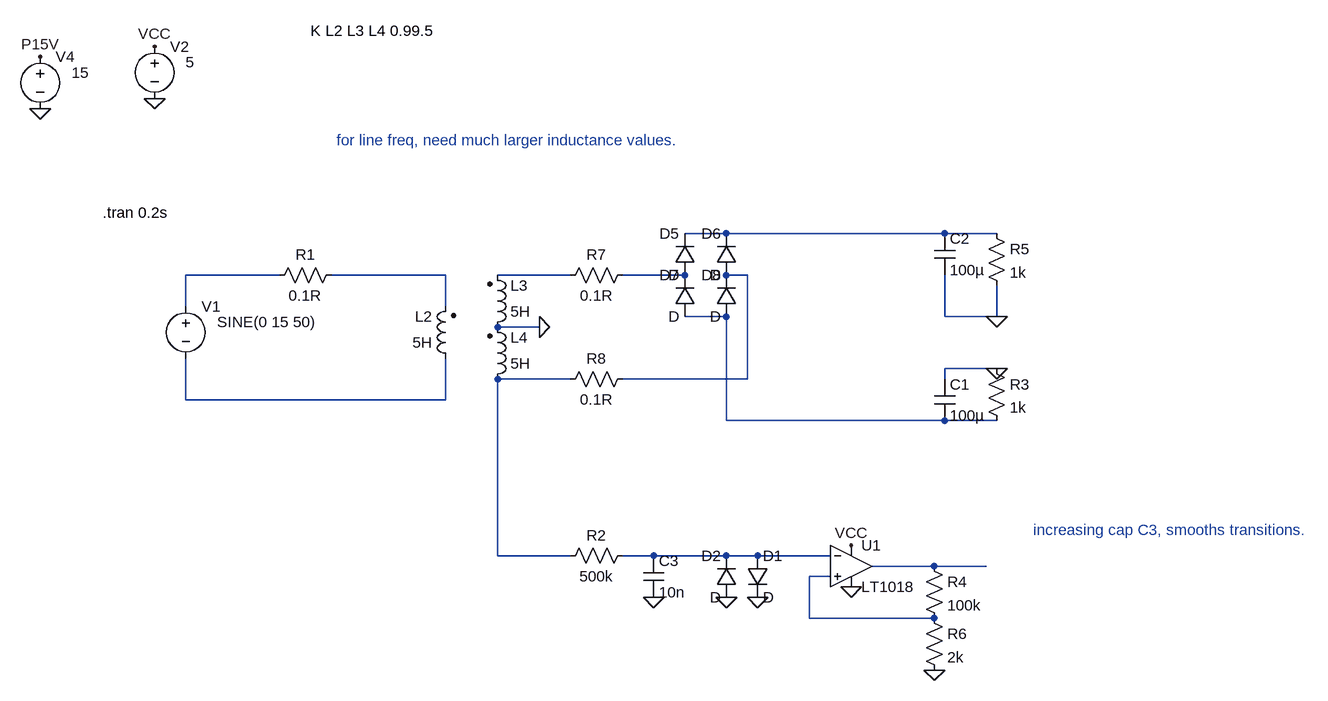
[diagram p0: schematic Draft101.asc]
Draft101.asc, the LTspice schematic file:
Version 4
SHEET 1 5720 1740
WIRE 1664 -144 1600 -144
WIRE 2000 -144 1664 -144
WIRE 2080 -144 2000 -144
WIRE 976 -80 832 -80
WIRE 1232 -80 1056 -80
WIRE 1424 -80 1312 -80
WIRE 1600 -80 1504 -80
WIRE 1696 -80 1664 -80
WIRE 832 -32 832 -80
WIRE 1232 -32 1232 -80
WIRE 1664 -16 1600 -16
WIRE 2000 -16 2000 -80
WIRE 2080 -16 2080 -64
WIRE 2080 -16 2000 -16
WIRE 1376 0 1312 0
WIRE 2080 64 2000 64
WIRE 1424 80 1312 80
WIRE 1696 80 1696 -80
WIRE 1696 80 1504 80
WIRE 2000 80 2000 64
WIRE 832 112 832 48
WIRE 1232 112 1232 48
WIRE 1232 112 832 112
WIRE 1664 144 1664 -16
WIRE 2000 144 1664 144
WIRE 2080 144 2000 144
WIRE 1312 352 1312 80
WIRE 1424 352 1312 352
WIRE 1552 352 1504 352
WIRE 1664 352 1552 352
WIRE 1712 352 1664 352
WIRE 1824 352 1712 352
WIRE 1984 368 1888 368
WIRE 2064 368 1984 368
WIRE 1824 384 1792 384
WIRE 1792 448 1792 384
WIRE 1984 448 1792 448
FLAG 784 -352 0
FLAG 784 -432 VCC
FLAG 608 -336 0
FLAG 608 -416 P15V
FLAG 2080 -16 0
FLAG 1376 0 0
FLAG 2080 64 0
FLAG 1856 400 0
FLAG 1856 336 VCC
FLAG 1664 416 0
FLAG 1712 416 0
FLAG 1984 528 0
FLAG 1552 416 0
SYMBOL voltage 784 -448 R0
WINDOW 123 0 0 Left 0
WINDOW 39 0 0 Left 0
WINDOW 3 48 40 Left 2
SYMATTR Value 5
SYMATTR InstName V2
SYMBOL ind2 1296 16 M180
WINDOW 0 36 80 Left 2
WINDOW 3 36 40 Left 2
SYMATTR InstName L3
SYMATTR Value 5H
SYMATTR Type ind
SYMBOL voltage 608 -432 R0
WINDOW 123 0 0 Left 0
WINDOW 39 0 0 Left 0
WINDOW 3 48 40 Left 2
SYMATTR Value 15
SYMATTR InstName V4
SYMBOL ind2 1248 64 R180
WINDOW 0 36 80 Left 2
WINDOW 3 36 40 Left 2
SYMATTR InstName L2
SYMATTR Value 5H
SYMATTR Type ind
SYMBOL diode 1616 -80 R180
WINDOW 0 24 64 Left 2
WINDOW 3 24 0 Left 2
SYMATTR InstName D5
SYMBOL diode 1680 -80 R180
WINDOW 0 24 64 Left 2
WINDOW 3 24 0 Left 2
SYMATTR InstName D6
SYMBOL diode 1616 -16 R180
WINDOW 0 24 64 Left 2
WINDOW 3 24 0 Left 2
SYMATTR InstName D7
SYMBOL diode 1680 -16 R180
WINDOW 0 24 64 Left 2
WINDOW 3 24 0 Left 2
SYMATTR InstName D8
SYMBOL cap 1984 -144 R0
SYMATTR InstName C2
SYMATTR Value 100µ
SYMBOL res 2064 -160 R0
SYMATTR InstName R5
SYMATTR Value 1k
SYMBOL ind2 1296 96 M180
WINDOW 0 36 80 Left 2
WINDOW 3 36 40 Left 2
SYMATTR InstName L4
SYMATTR Value 5H
SYMATTR Type ind
SYMBOL cap 1984 80 R0
SYMATTR InstName C1
SYMATTR Value 100µ
SYMBOL res 2064 48 R0
SYMATTR InstName R3
SYMATTR Value 1k
SYMBOL voltage 832 -48 R0
WINDOW 123 0 0 Left 0
WINDOW 39 0 0 Left 0
WINDOW 3 48 40 Left 2
SYMATTR Value SINE(0 15 50)
SYMATTR InstName V1
SYMBOL res 1072 -96 R90
WINDOW 0 0 56 VBottom 2
WINDOW 3 32 56 VTop 2
SYMATTR InstName R1
SYMATTR Value 0.1R
SYMBOL Comparators\\LT1018 1856 368 R0
SYMATTR InstName U1
SYMBOL res 1520 336 R90
WINDOW 0 0 56 VBottom 2
WINDOW 3 32 56 VTop 2
SYMATTR InstName R2
SYMATTR Value 500k
SYMBOL diode 1696 352 R0
SYMATTR InstName D1
SYMBOL diode 1680 416 R180
WINDOW 0 24 64 Left 2
WINDOW 3 24 0 Left 2
SYMATTR InstName D2
SYMBOL res 1968 352 R0
SYMATTR InstName R4
SYMATTR Value 100k
SYMBOL res 1968 432 R0
SYMATTR InstName R6
SYMATTR Value 2k
SYMBOL cap 1536 352 R0
SYMATTR InstName C3
SYMATTR Value 10n
SYMBOL res 1408 -64 R270
WINDOW 0 32 56 VTop 2
WINDOW 3 0 56 VBottom 2
SYMATTR InstName R7
SYMATTR Value 0.1R
SYMBOL res 1520 64 R90
WINDOW 0 0 56 VBottom 2
WINDOW 3 32 56 VTop 2
SYMATTR InstName R8
SYMATTR Value 0.1R
TEXT 1024 -456 Left 2 !K L2 L3 L4 0.99.5
TEXT 704 -176 Left 2 !.tran 0.2s
TEXT 1064 -288 Left 2 ;for line freq, need much larger inductance values.
TEXT 2136 312 Left 2 ;increasing cap C3, smooths transitions.

The netlist it stands for:
* Draft101.asc
V2 VCC 0 5
L3 0 N004 5H
V4 P15V 0 15
L2 N009 N003 5H
D5 N005 N001 D
D6 N006 N001 D
D7 N007 N005 D
D8 N007 N006 D
C2 N001 0 100µ
R5 N001 0 1k
L4 N008 0 5H
C1 0 N007 100µ
R3 0 N007 1k
V1 N002 N009 SINE(0 15 50)
R1 N003 N002 0.1R
XU1 N012 N010 VCC 0 N011 LT1018  ; pins In+ In- V+ V- OUT
R2 N010 N008 500k
D1 N010 0 D
D2 0 N010 D
R4 N011 N012 100k
R6 N012 0 2k
C3 N010 0 10n
R7 N004 N005 0.1R
R8 N006 N008 0.1R
.model D D
.lib standard.dio
K L2 L3 L4 0.99.5
.tran 0.2s
* for line freq, need much larger inductance values.
* increasing cap C3, smooths transitions.
.lib LTC1.lib
.backanno
.end